# Altium project New GT controller.PrjPcb
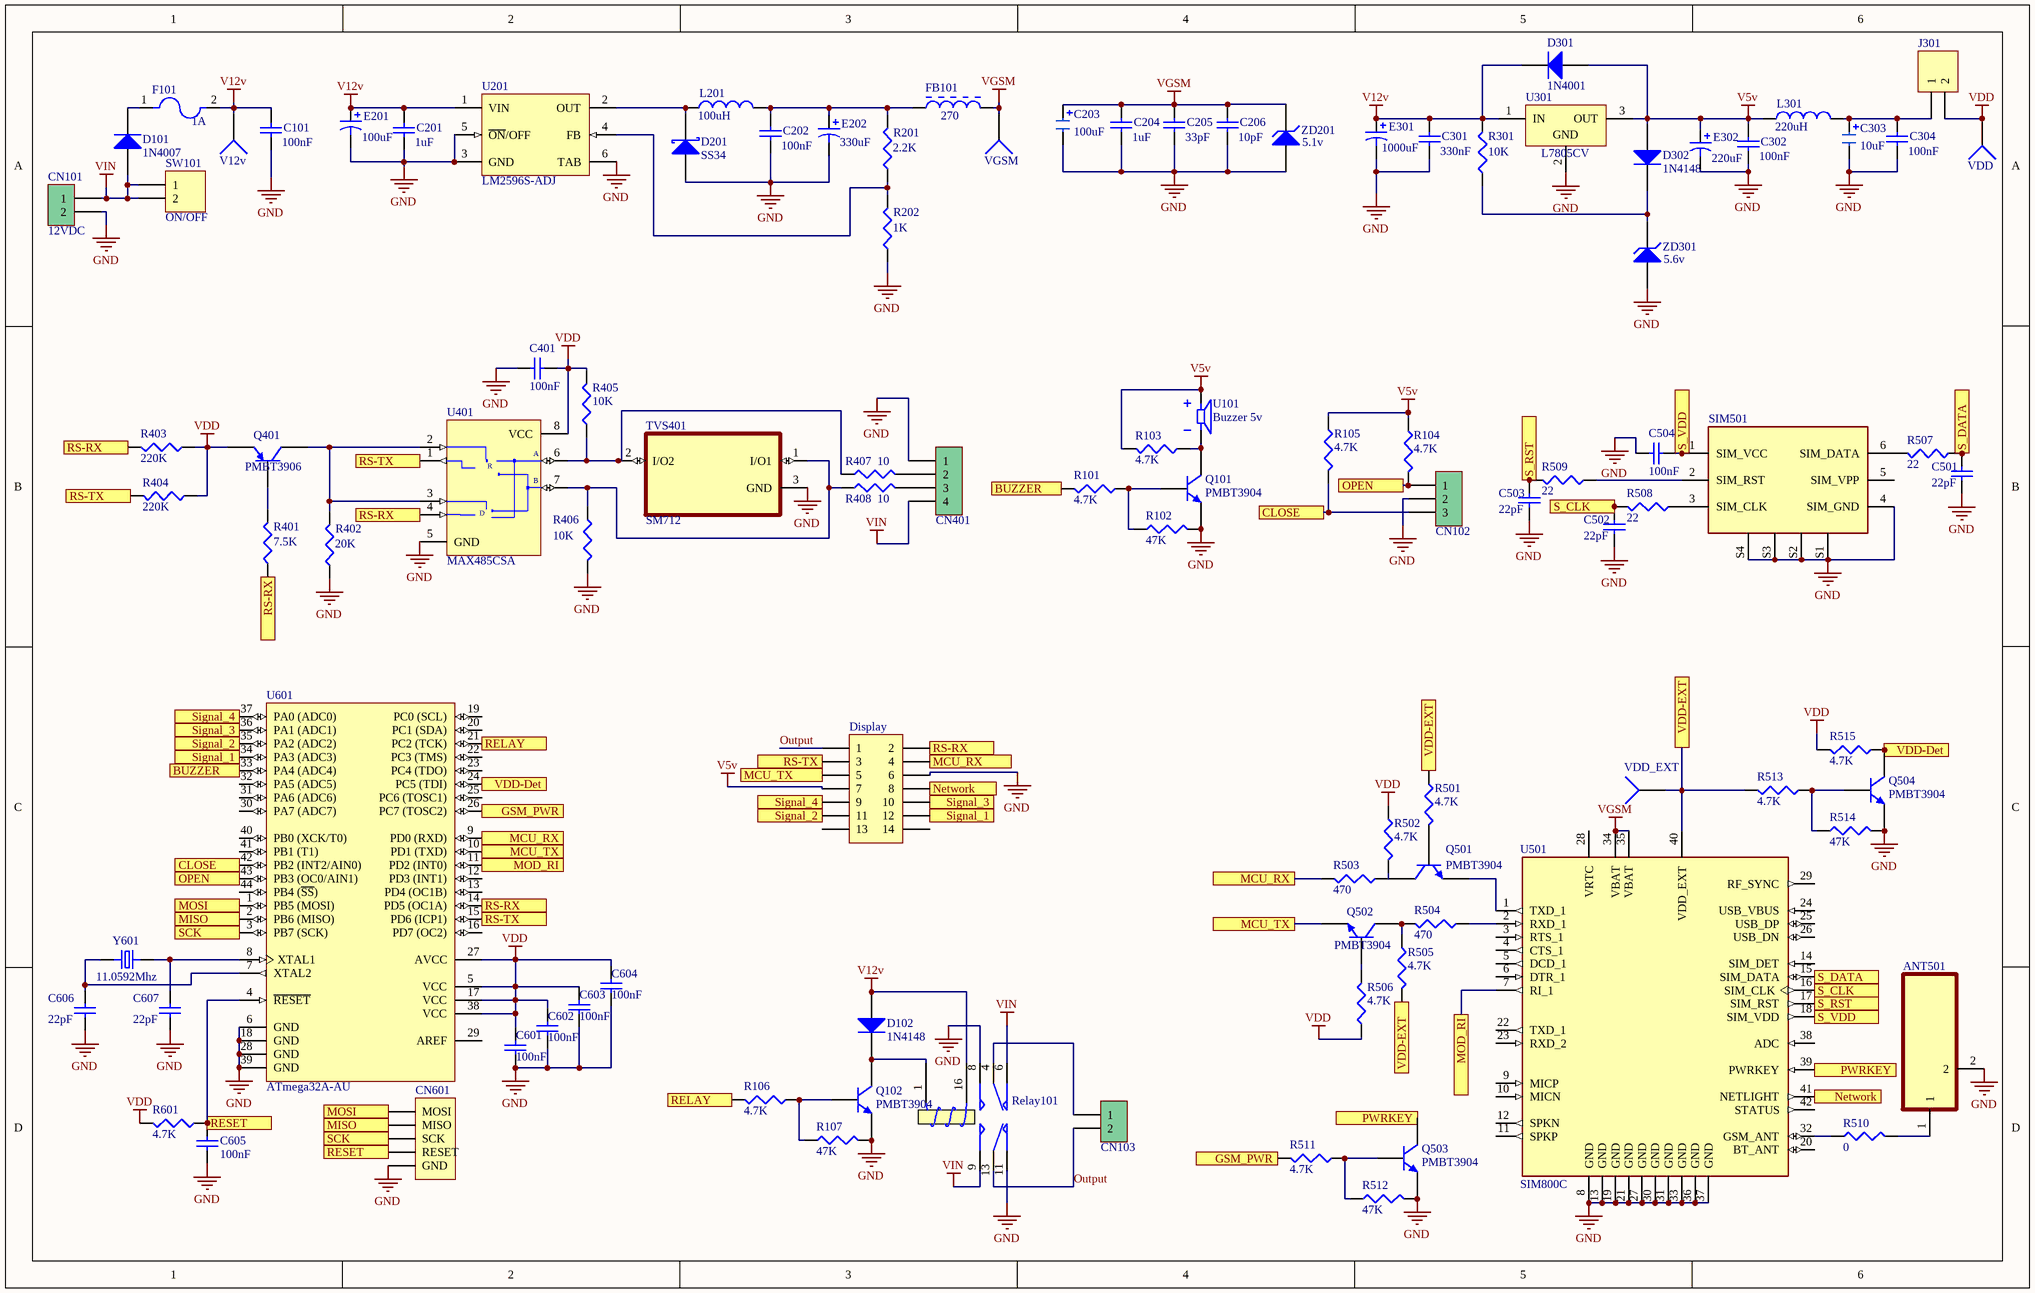
[diagram p0: New GT controller.SchDoc]
1 sheet, 102 parts. Net scope: flat (ports and power ports of the same name join across sheets).
Board file: New GT controller.PcbDoc

## Sheet New GT controller.SchDoc
size B

### Parts
ANT501  SMA connector  [SMA ANTENNA CONNECTOR]  (value not drawn)
C101  value 100nF  [C0805]  (hidden comment: Cap)
C201  value 1uF  [C1206]  (hidden comment: Cap)
C202  value 100nF  [C0805]  (hidden comment: Cap)
C203  value 100uF  [Tantalium CASE B]  (hidden comment: Tantalium Cap)
C204  value 1uF  [C1206]  (hidden comment: Cap)
C205  value 33pF  [C0805]  (hidden comment: Cap)
C206  value 10pF  [C0805]  (hidden comment: Cap)
C301  value 330nF  [C0805]  (hidden comment: Cap)
C302  value 100nF  [C0805]  (hidden comment: Cap)
C303  value 10uF  [Tantalium CASE A]  (hidden comment: Tantalium Cap)
C304  value 100nF  [C0805]  (hidden comment: Cap)
C401  value 100nF  [C0805]  (hidden comment: Cap)
C501  value 22pF  [C0805]  (hidden comment: Cap)
C502  value 22pF  [C0805]  (hidden comment: Cap)
C503  value 22pF  [C0805]  (hidden comment: Cap)
C504  value 100nF  [C0805]  (hidden comment: Cap)
C601  value 100nF  [C0805]  (hidden comment: Cap)
C602  value 100nF  [C0805]  (hidden comment: Cap)
C603  value 100nF  [C0805]  (hidden comment: Cap)
C604  value 100nF  [C0805]  (hidden comment: Cap)
C605  value 100nF  [C0805]  (hidden comment: Cap)
C606  value 22pF  [C0805]  (hidden comment: Cap)
C607  value 22pF  [C0805]  (hidden comment: Cap)
CN101  12VDC  [phoenix terminal R 2]
CN102  Phoenix terminal  [phoenix terminal R 3]  (value not drawn)
CN103  Phoenix terminal  [phoenix terminal R 2]  (value not drawn)
CN401  Phoenix terminal  [phoenix terminal 4]  (value not drawn)
CN601  Right Female Header 5-Pin  [HDR1X5]  (value not drawn)
D101  1N4007  [SMA]
D102  1N4148  [Mini MELF]
D201  SS34  [SMA]
D301  1N4001  [DO-41]
D302  1N4148  [Mini MELF]
Display  Header 7X2  [HDR2X7]  (value not drawn)
E201  value 100uF  [D]  (hidden comment: 94SS107X0010DBP)
E202  value 330uF  [E]  (hidden comment: 94SA107X0016EBP)
E301  value 1000uF  [F0]  (hidden comment: 94SP158X0004FBP)
E302  value 220uF  [D]  (hidden comment: 94SS107X0010DBP)
F101  value 1A  [FUSE SMD 2410]  (hidden comment: Fuse SMD)
FB101  value 270  [AXIAL-0.3]  (hidden comment: Ferrite Bead)
J301  Header 2  [HDR1X2]  (value not drawn)
L201  value 100uH  [IND POWER RH74]  (hidden comment: Inductor)
L301  value 220uH  [IND POWER CD54]  (hidden comment: Inductor)
Q101  PMBT3904  [SOT-23A_N]
Q102  PMBT3904  [SOT-23A_N]
Q401  PMBT3906  [SOT-23A_N]
Q501  PMBT3904  [SOT-23A_N]
Q502  PMBT3904  [SOT-23A_N]
Q503  PMBT3904  [SOT-23A_N]
Q504  PMBT3904  [SOT-23A_N]
R101  value 4.7K  [R0805]  (hidden comment: Res)
R102  value 47K  [R0805]  (hidden comment: Res)
R103  value 4.7K  [R0805]  (hidden comment: Res)
R104  value 4.7K  [R0805]  (hidden comment: Res)
R105  value 4.7K  [R0805]  (hidden comment: Res)
R106  value 4.7K  [R0805]  (hidden comment: Res)
R107  value 47K  [R0805]  (hidden comment: Res)
R201  value 2.2K  [R0805]  (hidden comment: Res)
R202  value 1K  [R0805]  (hidden comment: Res)
R301  value 10K  [R0805]  (hidden comment: Res)
R401  value 7.5K  [R0805]  (hidden comment: Res)
R402  value 20K  [R0805]  (hidden comment: Res)
R403  value 220K  [R0805]  (hidden comment: Res)
R404  value 220K  [R0805]  (hidden comment: Res)
R405  value 10K  [R0805]  (hidden comment: Res)
R406  value 10K  [R0805]  (hidden comment: Res)
R407  value 10  [R0805]  (hidden comment: Res)
R408  value 10  [R0805]  (hidden comment: Res)
R501  value 4.7K  [R0805]  (hidden comment: Res)
R502  value 4.7K  [R0805]  (hidden comment: Res)
R503  value 470  [R0805]  (hidden comment: Res)
R504  value 470  [R0805]  (hidden comment: Res)
R505  value 4.7K  [R0805]  (hidden comment: Res)
R506  value 4.7K  [R0805]  (hidden comment: Res)
R507  value 22  [R0805]  (hidden comment: Res)
R508  value 22  [R0805]  (hidden comment: Res)
R509  value 22  [R0805]  (hidden comment: Res)
R510  value 0  [R0805]  (hidden comment: Res)
R511  value 4.7K  [R0805]  (hidden comment: Res)
R512  value 47K  [R0805]  (hidden comment: Res)
R513  value 4.7K  [R0805]  (hidden comment: Res)
R514  value 47K  [R0805]  (hidden comment: Res)
R515  value 4.7K  [R0805]  (hidden comment: Res)
R601  value 4.7K  [R0805]  (hidden comment: Res)
Relay101  2C Relay 12V  [Relay v23105-a5001-a201]  (value not drawn)
SIM501  SIM Card Holder 6PIN  [SIM Card Holder]  (value not drawn)
SW101  ON/OFF  [HDR1X2]
TVS401  SM712  [SOT23-3]
U101  Buzzer 5v  [Buzzer 12mm]
U201  LM2596S-ADJ  [TS5B_N]
U301  L7805CV  [TO220]
U401  MAX485CSA  [NSO8_N]
U501  SIM800C  [LCC110P1570X1760X250-42N]
U601  ATmega32A-AU  [44A_N]
V12v  Socket  [PIN1]  (value not drawn)
VDD  Socket  [PIN1]  (value not drawn)
VDD_EXT  Socket  [PIN1]  (value not drawn)
VGSM  Socket  [PIN1]  (value not drawn)
Y601  value 11.0592Mhz  [XTAL THD]  (hidden comment: Crystal Oscillator)
ZD201  value 5.1v  [Mini MELF]  (hidden comment: Diode Zener)
ZD301  value 5.6v  [Mini MELF]  (hidden comment: Diode Zener)

### Ports
BUZZER, CLOSE, GSM_PWR, MCU_RX, MCU_TX, MISO, MOD_RI, MOSI, Network, OPEN, PWRKEY, RELAY, RESET, RS-RX, RS-TX, S_CLK, S_DATA, S_RST, S_VDD, SCK, Signal_1, Signal_2, Signal_3, Signal_4, VDD-Det, VDD-EXT

### Nets
GND: ANT501.2 C101.1 C201.1 C202.1 C203.2 C204.1 C205.1 C206.1 C301.1 C302.1 C303.2 C304.1 C401.2 C501.2 C502.2 C503.2 C504.2 C601.2 C602.2 C603.2 C604.2 C605.2 C606.2 C607.2 CN101.2 CN102.2 CN401.1 CN601.5(GND) D201.1(A) Display.6 E201.2 E202.2 E301.2 E302.2 Q101.2(E) Q102.2(E) Q503.2(E) Q504.2(E) R102.2 R107.2 R202.1 R402.1 R406.2 R512.2 R514.2 Relay101.8(NO) Relay101.11(NC) SIM501.4(SIM_GND) SIM501.S1 SIM501.S2 SIM501.S3 SIM501.S4 TVS401.3(GND) U201.3(GND) U201.5(~{ON}/OFF) U201.6(TAB) U301.2(GND) U401.5(GND) U501.8(GND) U501.13(GND) U501.19(GND) U501.21(GND) U501.27(GND) U501.30(GND) U501.31(GND) U501.33(GND) U501.36(GND) U501.37(GND) U601.6(GND) U601.18(GND) U601.28(GND) U601.39(GND) ZD201.1(A) ZD301.1(A)
V5v: C302.2 D301.1(A) D302.1(A) Display.7 E302.1 L301.1 R103.2 R104.1 R105.1 U101.P U301.3(OUT)
V12v: C101.2 C201.2 C301.2 D102.1(A) D301.2(K) E201.1 E301.1 F101.2 R301.2 Relay101.16(T1) U201.1(VIN) U301.1(IN) V12v.1
VDD: C401.1 C601.1 C602.1 C603.1 C604.1 J301.2 Q401.2(E) R403.1 R404.1 R405.2 R502.1 R506.1 R515.2 R601.2 U401.8(VCC) U601.5(VCC) U601.17(VCC) U601.27(AVCC) U601.38(VCC) VDD.1
VGSM: C203.1 C204.2 C205.2 C206.2 FB101.2 U501.34(VBAT) U501.35(VBAT) VGSM.1 ZD201.2(K)
VIN: CN101.1 CN401.4 D101.1(A) Relay101.6(NC) Relay101.9(NO) SW101.1 SW101.2
Output: CN103.2 Display.1 Relay101.13(COM)
NetANT501_1: ANT501.1 R510.2
NetC202_2: C202.2 E202.1 FB101.1 L201.2 R201.2
NetC303_1: C303.1 C304.2 J301.1 L301.2
NetC501_1: C501.1 R507.1 U501.15(SIM_DATA) ; port S_DATA
NetC502_1: C502.1 R508.2 U501.16(SIM_CLK) ; port S_CLK
NetC503_1: C503.1 R509.2 U501.17(SIM_RST) ; port S_RST
NetC504_1: C504.1 SIM501.1(SIM_VCC) U501.18(SIM_VDD) ; port S_VDD
NetC605_1: C605.1 CN601.4(RESET) R601.1 U601.4(~{RESET}) ; port RESET
NetC606_1: C606.1 U601.7(XTAL2) Y601.1
NetC607_1: C607.1 U601.8(XTAL1) Y601.2
NetCN102_1: CN102.1 R104.2 U601.43(PB3_(OC0/AIN1)) ; port OPEN
NetCN102_3: CN102.3 R105.2 U601.42(PB2_(INT2/AIN0)) ; port CLOSE
NetCN103_1: CN103.1 Relay101.4(COM)
NetCN401_2: CN401.2 R407.2
NetCN401_3: CN401.3 R408.2
NetCN601_1: CN601.1(MOSI) U601.1(PB5_(MOSI)) ; port MOSI
NetCN601_2: CN601.2(MISO) U601.2(PB6_(MISO)) ; port MISO
NetCN601_3: CN601.3(SCK) U601.3(PB7_(SCK)) ; port SCK
NetD101_2: D101.2(K) F101.1
NetD102_2: D102.2(K) Q102.3(C) Relay101.1(T2)
NetD201_2: D201.2(K) L201.1 U201.2(OUT)
NetD302_2: D302.2(K) R301.1 ZD301.2(K)
NetDisplay_2: Display.2 R401.1 R403.2 U401.4(DI) U601.14(PD5_(OC1A)) ; port RS-RX
NetDisplay_3: Display.3 R404.2 U401.1(RO) U601.15(PD6_(ICP1)) ; port RS-TX
NetDisplay_4: Display.4 R503.2 U601.9(PD0_(RXD)) ; port MCU_RX
NetDisplay_5: Display.5 Q502.2(E) U601.10(PD1_(TXD)) ; port MCU_TX
NetDisplay_8: Display.8 U501.41(NETLIGHT) ; port Network
NetDisplay_9: Display.9 U601.37(PA0_(ADC0)) ; port Signal_4
NetDisplay_10: Display.10 U601.36(PA1_(ADC1)) ; port Signal_3
NetDisplay_11: Display.11 U601.35(PA2_(ADC2)) ; port Signal_2
NetDisplay_12: Display.12 U601.34(PA3_(ADC3)) ; port Signal_1
NetQ101_1: Q101.1(B) R101.1 R102.1
NetQ101_3: Q101.3(C) R103.1 U101.N
NetQ102_1: Q102.1(B) R106.1 R107.1
NetQ401_1: Q401.1(B) R401.2
NetQ401_3: Q401.3(C) R402.2 U401.2(~{RE}) U401.3(DE)
NetQ501_1: Q501.1(B) R501.2
NetQ501_2: Q501.2(E) U501.1(TXD_1)
NetQ501_3: Q501.3(C) R502.2 R503.1
NetQ502_1: Q502.1(B) R506.2
NetQ502_3: Q502.3(C) R504.2 R505.1
NetQ503_1: Q503.1(B) R511.1 R512.1
NetQ503_3: Q503.3(C) U501.39(PWRKEY) ; port PWRKEY
NetQ504_1: Q504.1(B) R513.1 R514.1
NetQ504_3: Q504.3(C) R515.1 U601.24(PC5_(TDI)) ; port VDD-Det
NetR101_2: R101.2 U601.33(PA4_(ADC4)) ; port BUZZER
NetR106_2: R106.2 U601.21(PC2_(TCK)) ; port RELAY
NetR201_1: R201.1 R202.2 U201.4(FB)
NetR405_1: R405.1 R407.1 TVS401.2(I/O2) U401.6(A)
NetR406_1: R406.1 R408.1 TVS401.1(I/O1) U401.7(B)
NetR501_1: R501.1 R505.2 R513.2 U501.40(VDD_EXT) VDD_EXT.1 ; port VDD-EXT
NetR504_1: R504.1 U501.2(RXD_1)
NetR507_2: R507.2 SIM501.6(SIM_DATA)
NetR508_1: R508.1 SIM501.3(SIM_CLK)
NetR509_1: R509.1 SIM501.2(SIM_RST)
NetR510_1: R510.1 U501.32(GSM_ANT)
NetR511_2: R511.2 U601.26(PC7_(TOSC2)) ; port GSM_PWR
NetU501_7: U501.7(RI_1) U601.11(PD2_(INT0)) ; port MOD_RI

Not connected (* = marked no-connect by the designer): Display 13 14; SIM501 5(SIM_VPP); U501 3(RTS_1) 4(CTS_1) 5(DCD_1) 6(DTR_1) 9(MICP) 10(MICN) 11(SPKP) 12(SPKN) 14(SIM_DET) 20(BT_ANT) 22(TXD_1) 23(RXD_2) 24(USB_VBUS) 25(USB_DP) 26(USB_DN) 28(VRTC) 29(RF_SYNC) 38(ADC) 42(STATUS); U601 12(PD3_(INT1)) 13(PD4_(OC1B)) 16(PD7_(OC2)) 19(PC0_(SCL)) 20(PC1_(SDA)) 22(PC3_(TMS)) 23(PC4_(TDO)) 25(PC6_(TOSC1)) 29(AREF) 30(PA7_(ADC7)) 31(PA6_(ADC6)) 32(PA5_(ADC5)) 40(PB0_(XCK/T0)) 41(PB1_(T1)) 44(PB4_(~{SS}))

### Notes on the sheet
- (in symbol MAX485CSA) R; D

### Library data of the parts
ANT501 = SMA connector: SMA Connector Plug, Male Pin 50Ohm Through Hole, Right Angle Solder; MP: 901-9894-RFX; MF: Amphenol RF; Package: None; SnapEDA_Link: https://www.snapeda.com/parts/901-9894-RFX/Amphenol%20RF%20Division/view-part/34657/?ref=snap; Price: None; Value: *; Availability: Unavailable
C101 C201 C202 C204-C206 C301 C302 C304 C401 C501-C504 C601-C607 = Cap: Capacitor
C203 C303 = Cap Pol2: Polarized Capacitor Tantalium
CN101 CN103 = Phoenix terminal R 2: Right Terminal 2 Pin; Designer: Seyed Mohsen Ghasemain; E-mail: picpars@gmail.com; ComponentLinkURL: www.picpars.com
CN102 = Phoenix terminal R 3: Right Terminal 3 Pin; Designer: Seyed Mohsen Ghasemain; E-mail: picpars@gmail.com; ComponentLinkURL: www.picpars.com
CN401 = Phoenix terminal 4: Terminal 4 Pin; Designer: Seyed Mohsen Ghasemain; E-mail: picpars@gmail.com; ComponentLinkURL: www.picpars.com
CN601 = Header 5: Header, 5-Pin; LatestRevisionDate: 17-Jul-2002; LatestRevisionNote: Re-released for DXP Platform.; Publisher: Altium Limited
D101 = Diode: Default Diode; Published: 8-Jun-2000; LatestRevisionDate: 17-Jul-2002; LatestRevisionNote: Re-released for DXP Platform.; PackageVersion: Sep-1996; PackageReference: SMC; Publisher: Altium Limited; PackageDescription: DO-214-AB/SMC; 2 C-Bend Leads; Body 7.9 x 5.9 mm, inc. leads (LxW); Code_JEDEC: DO-214-AB
D102 D302 = Diode 1N4148: High Conductance Fast Diode; PackageDescription: Diode
D201 = SS36: Schottky Rectifier; PackageDescription: DO-214-AB/SMC; 2 C-Bend Leads; Body 7.9 x 5.9 mm, inc. leads (LxW)
D301 = 1N4001: 1.0 Ampere General Purpose Rectifier; Published: 8-Jun-2000; LatestRevisionDate: 17-Jul-2002; LatestRevisionNote: Re-released for DXP Platform.; DatasheetDocument: 1998; PackageDocument: Aug-1999; PackageReference: DO-41; Publisher: Altium Limited; Code_JEDEC: DO-204-AL; ComponentLink1Description: Manufacturer Link; ComponentLink1URL: http://www.fairchildsemi.com/; ComponentLink2Description: Pinout Specification; ComponentLink2URL: http://www.fairchildsemi.com/ds/1N%2F1N4001.pdf
Display = Header 7X2: Header, 7-Pin, Dual row; LatestRevisionDate: 17-Jul-2002; LatestRevisionNote: Re-released for DXP Platform.; Publisher: Altium Limited
E201 E302 = 94SS107X0010DBP: Solid Aluminum Capacitor with Organic Semiconductor Electrolyte: 100uF, 10V, Bulk Pack; Note: Part Numbers shown are for ± 20% capacitance tolerance (X0).; PCB_Layout: Complies with Manufacturer's Recommendation.; DrillSize: Nominal, Rounded to the nearest 0.1mm; Published: 19-Mar-2004; DatasheetDocument: 23-May-2001; PackageReference: D; Publisher: Altium Limited; ComponentLink1Description: Manufacturer Link; ComponentLink1URL: http://www.vishay.com/; ComponentLink2Description: Datasheet; ComponentLink2URL: http://www.vishay.com/docs/90008/94ss.pdf
E202 = 94SA107X0016EBP: Solid Aluminum Capacitor with Organic Semiconductor Electrolyte: 100uF, 16V, Bulk Pack; Note: Part Numbers shown are for ± 20% capacitance tolerance (X0).; PCB_Layout: Complies with Manufacturer's Recommendation.; DrillSize: Nominal, Rounded to the nearest 0.1mm; Published: 19-Mar-2004; DatasheetDocument: 29-Jun-2001; PackageReference: E; Publisher: Altium Limited; ComponentLink1Description: Manufacturer Link; ComponentLink1URL: http://www.vishay.com/; ComponentLink2Description: Datasheet; ComponentLink2URL: http://www.vishay.com/docs/90003/94sa.pdf
E301 = 94SP158X0004FBP: Solid Aluminum Capacitor with Organic Semiconductor Electrolyte: 1500uF, 4V, Bulk Pack; Note: Part Numbers shown are for ± 20% capacitance tolerance (X0).; PCB_Layout: Complies with Manufacturer's Recommendation.; DrillSize: Nominal, Rounded to the nearest 0.1mm; Published: 19-Mar-2004; DatasheetDocument: 2-Jul-2001; PackageReference: F0; Publisher: Altium Limited; ComponentLink1Description: Manufacturer Link; ComponentLink1URL: http://www.vishay.com/; ComponentLink2Description: Datasheet; ComponentLink2URL: http://www.vishay.com/docs/90009/94sp.pdf
F101 = Fuse SMD: 2410 SMT Fuse | Quick Acting | 1A; MF: Bel Fuse; MP: 0679L1000-05; SnapEDA_Link: https://www.snapeda.com/parts/0679L1000-05/Bel%20Fuse/view-part/1313867/?ref=snap; Availability: Warning; Price: None; Package: SMD-2 Bel Fuse; Purchase-URL: https://pricing.snapeda.com/search/part/0679L1000-05/?ref=eda
J301 SW101 = Header 2: Header, 2-Pin; LatestRevisionDate: 17-Jul-2002; LatestRevisionNote: Re-released for DXP Platform.; Publisher: Altium Limited
L201 L301 = Inductor: Inductor SMD; PackageDescription: Inductor
Q101 Q102 Q501-Q504 = BC817-25: NPN General Purpose Amplifier; Published: 8-Jun-2000; LatestRevisionDate: 20-Nov-2009; LatestRevisionNote: IPC-7351 Footprint Added.; DatasheetVersion: 1997; PackageVersion: Sep-1998; PackageReference: SOT-23A; Publisher: Altium Limited; PackageDescription: 3-Pin SOT-23 Package 0.95 mm Pitch, 2.3 mm Lead Span; ComponentLink1Description: Manufacturer Link; ComponentLink1URL: http://www.fairchildsemi.com/; ComponentLink2Description: Discontinuation Notice; ComponentLink2URL: http://www.fairchildsemi.com/obsolete/obs.jsp
Q401 = BC807-25: PNP General Purpose Amplifier; Published: 8-Jun-2000; LatestRevisionDate: 20-Nov-2009; LatestRevisionNote: IPC-7351 Footprint Added.; DatasheetVersion: 1997; PackageVersion: Sep-1998; PackageReference: SOT-23A; Publisher: Altium Limited; PackageDescription: 3-Pin SOT-23 Package 0.95 mm Pitch, 2.3 mm Lead Span; ComponentLink1Description: Manufacturer Link; ComponentLink1URL: http://www.fairchildsemi.com/; ComponentLink2Description: Datasheet; ComponentLink2URL: http://www.fairchildsemi.com/ds/BC%2FBC807.pdf
R101-R107 R201 R202 R301 R401-R408 R501-R515 R601 = Res: Resistor; PackageDescription: Chip Resistor
Relay101 = Relay-8Pin: 2C Telecommunication Relay
SIM501 = SIM Card Holder 6PIN: 6 Position Card Connector SIM Card Surface Mount, Right Angle Gold; MP: 693010020611; MF: Wurth Electronics; Price: None; SnapEDA_Link: https://www.snapeda.com/parts/693010020611/Wurth%20Electronics%20Inc./view-part/514470/?ref=snap; Package: None; Value: *; Availability: Unavailable
TVS401 = SM712: 31V, 19V Clamp 19A _8/20Âµs_ Ipp Tvs Diode Surface Mount SOT-23-3; MF: Semtech; Package: SOT-23 Semtech; Price: None; Value: *; MP: SM712; SnapEDA_Link: https://www.snapeda.com/parts/SM712/Semtech/view-part/4219095/?ref=snap; Availability: Unavailable
U101 = Buzzer passive 12mm: 12 mm, 5 Vdc, 85 dB, Through Hole, Driving Circuit, Magnetic Audio Indicator Buzzer; MF: CUI Devices; MP: CMI-1295-0585T; CUI_purchase_URL: https://www.cuidevices.com/product/audio/buzzers/audio-indicators/cmi-1295-0585t?utm_source=snapeda.com&utm_medium=referral&utm_campaign=snapedaBOM; SnapEDA_Link: https://www.snapeda.com/parts/CMI-1295-0585T/CUI%20Devices/view-part/3662512/?ref=snap; Value: *; Availability: Unavailable; Price: None; Package: CUI Inc.
U201 = LM2596S-ADJ: SIMPLE SWITCHER® Power Converter 150 KHz 3A Step-Down Voltage Regulator, 5-pin TO-263; PackageDescription: TO-263, Molded, .400 x .390 x .180in, 5 Lead, .067in Pitch, Surface Mount; PartNumber: LM2596S-ADJ; PinCount: 5
U301 = L7805CV: Positive Voltage Regulator, 5V, 3-Pin TO-220; DatasheetVersion: Nov-2011; PackageVersion: ver3.0; PackageReference: TO220; PackageDescription: TO, Thru-Hole, Vertical, Heatsink Mounted; 3 In-Line Leads; Pitch 2.54 mm; PartNumber: L7805CV; ComponentLink1Description: Manufacturer URL; ComponentLink1URL: http://www.st.com; ComponentLink2Description: Datasheet; ComponentLink2URL: http://www.st.com/internet/com/TECHNICAL_RESOURCES/TECHNICAL_LITERATURE/DATASHEET/CD00000444.pdf; ComponentLink3Description: Package Specification; ComponentLink3URL: http://www.st.com/internet/com/TECHNICAL_RESOURCES/TECHNICAL_LITERATURE/PACKAGE_INFORMATION/CD00004649.pdf
U401 = MAX485CSA: Low-Power, Slew-Rate-Limited RS-485/RS-422 Transceiver; Published: 16-Jan-2001; LatestRevisionDate: 13-Apr-2006; LatestRevisionNote: IPC-7351 Footprint Added.; DatasheetVersion: Feb-1996; PackageReference: NSO8; Publisher: Altium Limited; PackageDescription: 8-Pin Small Outline Integrated Circuit 1.27 mm Pitch; Code_JEDEC: MS-012-AA; Code_IPC: SOIC127P600-8; ComponentLink1Description: Manufacturer Link; ComponentLink1URL: http://www.maxim-ic.com/; ComponentLink2Description: Datasheet; ComponentLink2URL: http://pdfserv.maxim-ic.com/en/ds/MAX1487-MAX491.pdf
U501 = SIM800C: Module: GSM/Bluetooth; GPRS; 2G; 1800MHz, 900MHz; 85.6kbps; SMD; MF: Simcom; MP: SIM800C; Availability: Unavailable; Package: None; Value: *; Price: None; SnapEDA_Link: https://www.snapeda.com/parts/SIM800C/SIMcom%20Wireless%20solutions%20Co.%2CLtd/view-part/571323/?ref=snap
U601 = ATmega32A-AU: 8-bit AVR Microcontroller, 2.7-5.5V, 16MHz, 32KB Flash, 1KB EEPROM, 2KB SRAM, 44-pin TQFP, Industrial Grade (-40°C to 85°C); DatasheetVersion: revC, Feb-2011; PackageVersion: revC, Oct-2010; PackageReference: 44A; PackageDescription: 44-Pin Plastic Thin Profile Quad Flat Pack, 10 x 10 x 1.0 mm Body, 0.8 mm Pitch (TQFP); Code_JEDEC: MS-026-ACB; ComponentLink1Description: Manufacturer URL; ComponentLink1URL: http://www.atmel.com/; ComponentLink2Description: ATmega32A Datasheet; ComponentLink2URL: http://www.atmel.com/dyn/resources/prod_documents/doc8155.pdf; ComponentLink3Description: ATmega32A Summary; ComponentLink3URL: http://www.atmel.com/dyn/resources/prod_documents/8155S.pdf
Y601 = Crystal Oscillator: 10MHz ±30ppm Crystal 18pF 60 Ohms; MF: ECS Inc.; MP: ECS-100-18-4X; Package: HC49/US ECS International; Digi-Key_Part_Number: X1080-ND; SnapEDA_Link: https://www.snapeda.com/parts/ECS-100-18-4X/ECS%20Inc./view-part/583488/?ref=snap
ZD201 ZD301 = Diode Zener: Zener Diode; PackageDescription: Zener Diode
FB101 = Ferrite Bead: PackageDescription: Chip Inductor
V12v VDD VDD_EXT VGSM = Socket: LatestRevisionDate: 17-Jul-2002; LatestRevisionNote: Re-released for DXP Platform.; Publisher: Altium Limited